# EAGLE design PLclose (EAGLE 9.4.2)
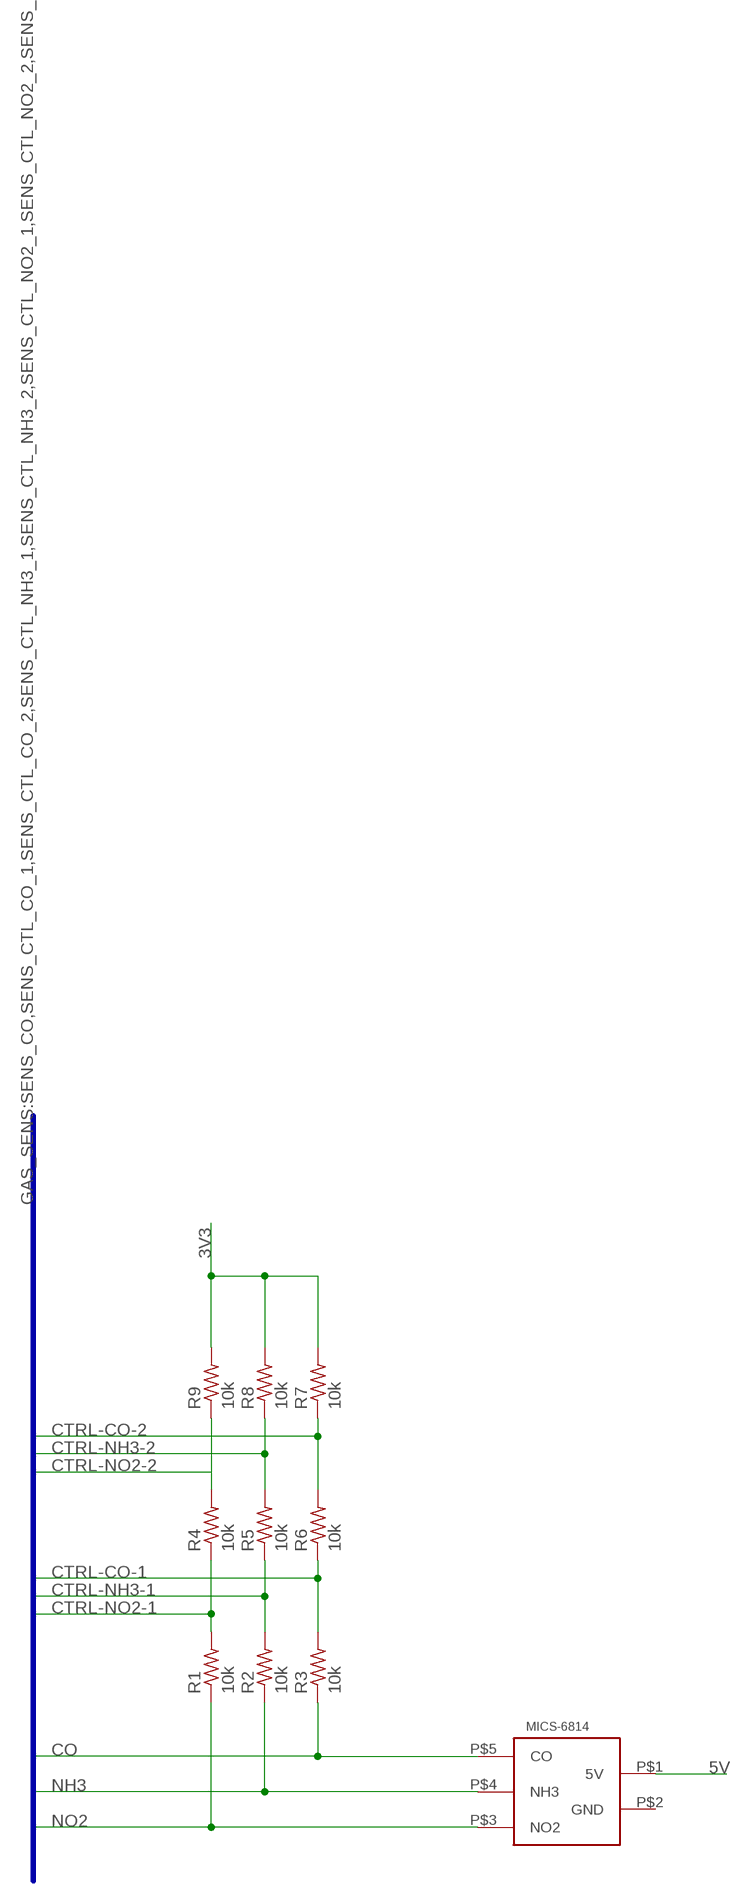
[diagram p0: schematic, sheet 1]

## Parts
MICS-6814  MICS-6814  [MICS-6814]
R1  10k  R-US_R0603  [R0603]
R2  10k  R-US_R0603  [R0603]
R3  10k  R-US_R0603  [R0603]
R4  10k  R-US_R0603  [R0603]
R5  10k  R-US_R0603  [R0603]
R6  10k  R-US_R0603  [R0603]
R7  10k  R-US_R0603  [R0603]
R8  10k  R-US_R0603  [R0603]
R9  10k  R-US_R0603  [R0603]

## Nets
3V3: R7.2 R8.2 R9.2
5V: MICS-6814.P$1(5V)
CO: MICS-6814.P$5(CO) R3.1
CTRL-CO-1: R3.2 R6.1
CTRL-CO-2: R6.2 R7.1
CTRL-NH3-1: R2.2 R5.1
CTRL-NH3-2: R5.2 R8.1
CTRL-NO2-1: R1.2 R4.1
CTRL-NO2-2: R4.2 R9.1
NH3: MICS-6814.P$4(NH3) R2.1
NO2: MICS-6814.P$3(NO2) R1.1
Unconnected: MICS-6814.P$2(GND)

## Buses
GAS_SENS:SENS_CO,SENS_CTL_CO_1,SENS_CTL_CO_2,SENS_CTL_NH3_1,SENS_CTL_NH3_2,SENS_CTL_NO2_1,SENS_CTL_NO2_2,SENS_NH3,SENS_NO2

## Library data of the parts
MICS-6814 = CanCubeSat:MICS-6814
R1-R9 = resistor:R-US_: RESISTOR, American symbol

## Board
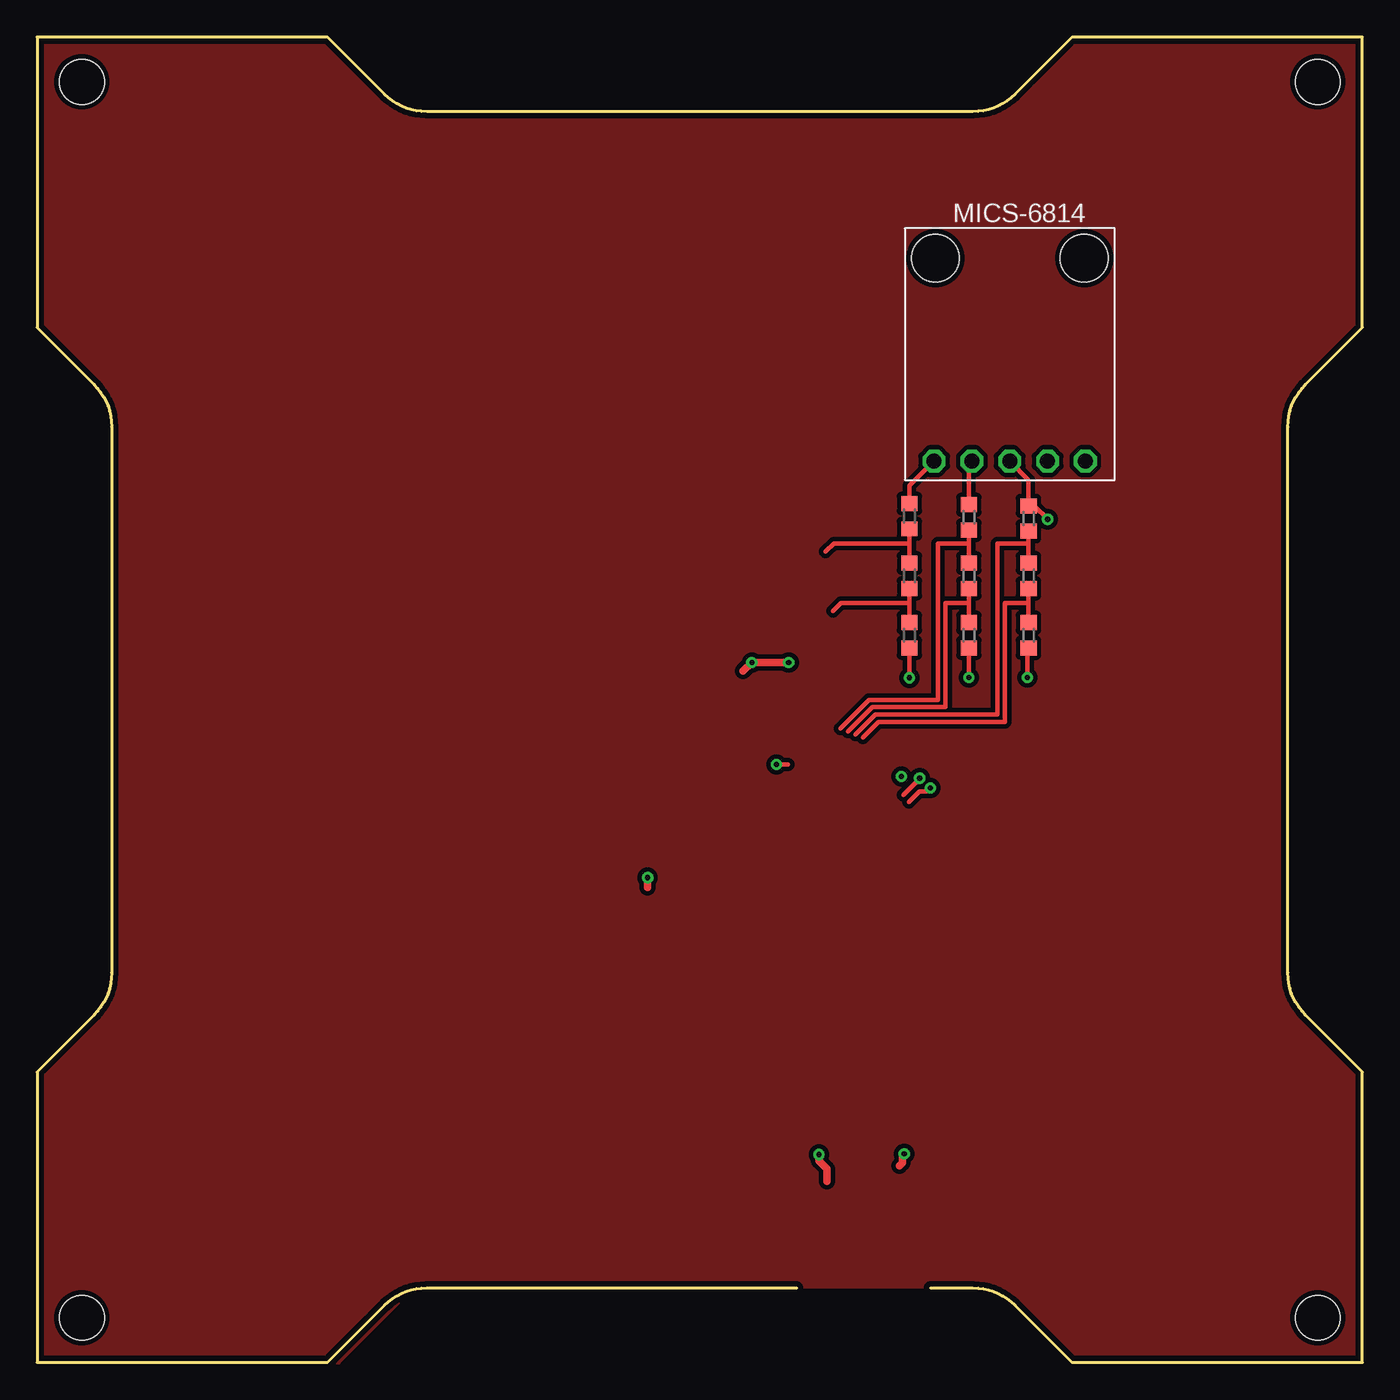
[diagram p1: board, top side]
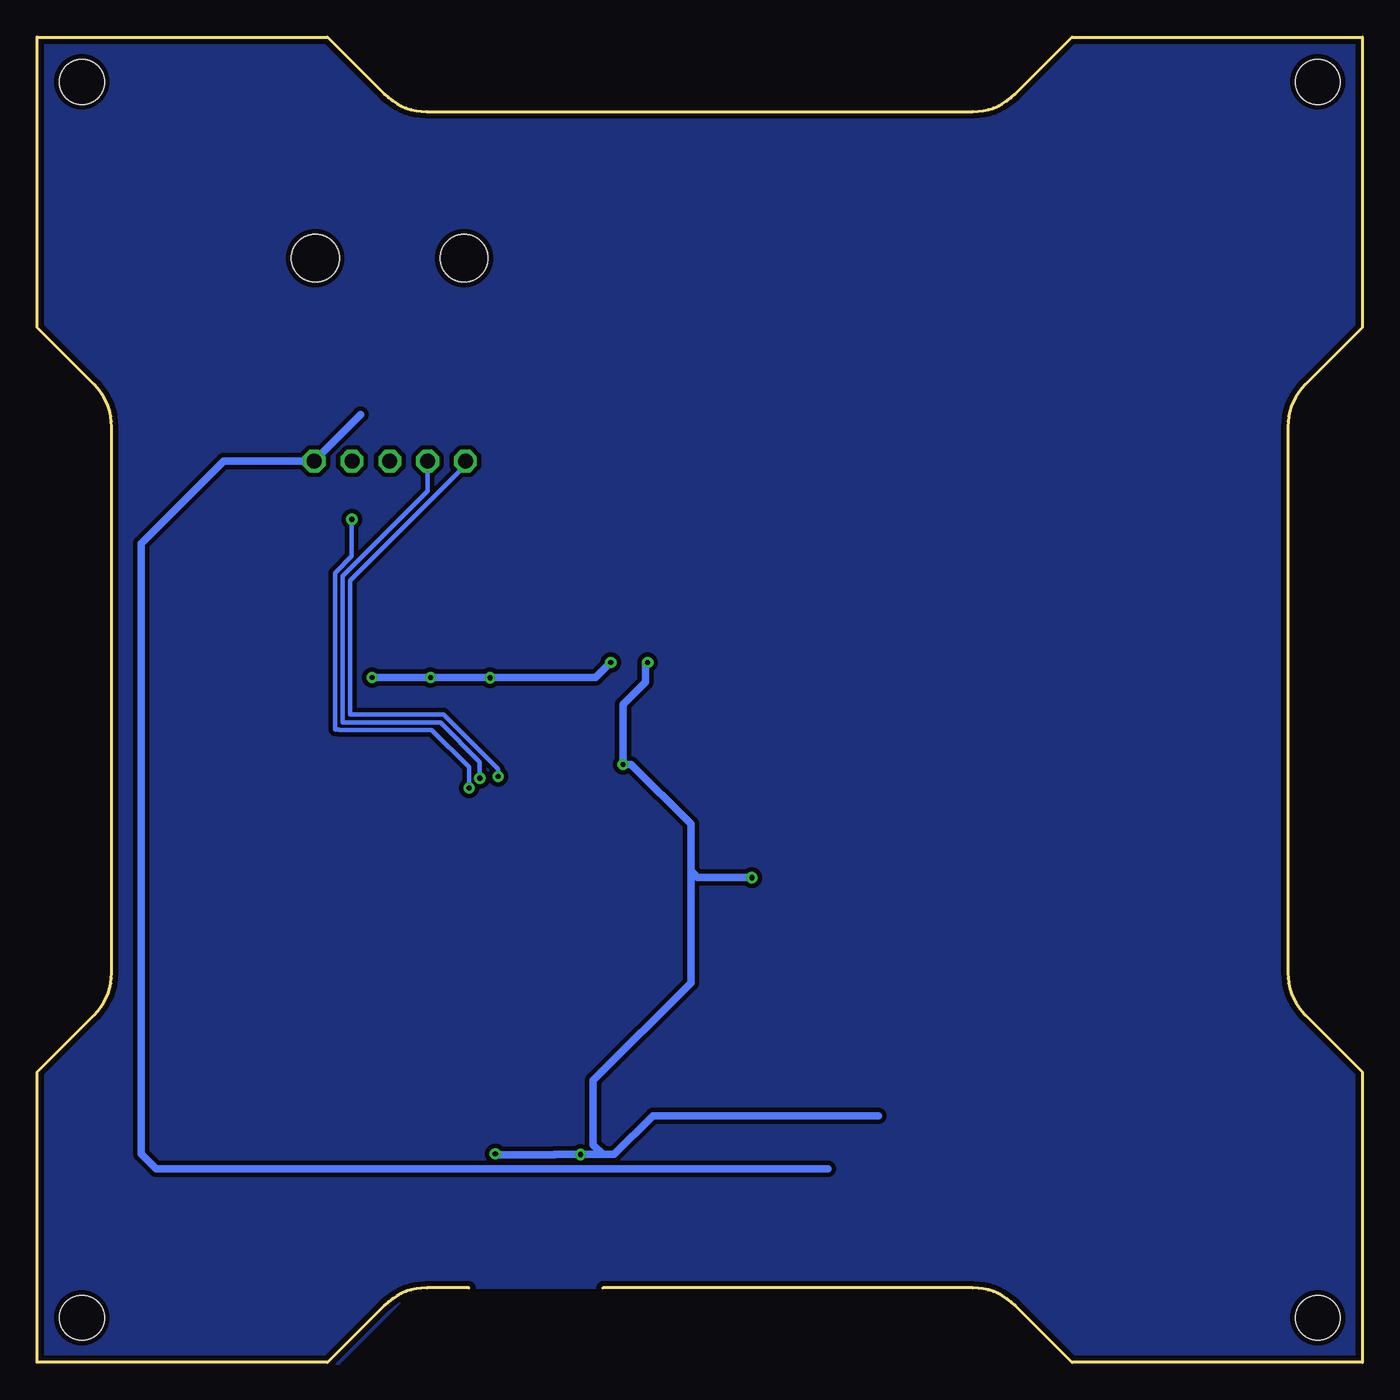
[diagram p2: board, bottom side, seen from below]

Size 89 x 89 mm. Coordinates in mm from the lower left corner, seen from the top.
Outline: 51,5 26.16,5 arc45 23.33,3.83 19.5,0 0,0 0,19.5 3.83,23.33 arc45 5,26.16 5,62.84 arc45 3.83,65.67 0,69.5 0,89 19.5,89 23.33,85.17 arc45 26.16,84 62.84,84 arc45 65.67,85.17 69.5,89 89,89 89,69.5 85.17,65.67 arc45 84,62.84 84,26.16 arc45 85.17,23.33 89,19.5 89,0 69.5,0 65.67,3.83 arc45 62.84,5 60,5
Copper layers (1*16): Top 0.035mm / dielectric 1.5mm / Bottom 0.035mm
Design rules "default *": minimum track width 0.3mm, minimum drill 0.35mm, track to track 0.2mm, track to pad 0.2mm, pad to pad 0.2mm, via to via 0.2mm, smd to smd 0.2mm, copper to edge 0.35mm, drill to drill 6mil, minimum pad ring 10mil, minimum via ring 8mil, stop-mask expansion 2mil, vias tented up to drill 0mil, thermal gap 10mil
Holes 3 mm at 3,3 86,3 86,86 3,86

### Footprints (pad centres in the part's own frame; a part is rotated, then mirrored left to right if it is on the bottom)
MICS-6814 = drill 1.016 octagon: P$1 -5.08,7.18; P$2 -2.54,7.18; P$3 0,7.18; P$4 2.54,7.18; P$5 5.08,7.18 | hole 3.2: -5,-6.45; 5,-6.45
R0603 = smd 1 x 1.1: 1 -0.85,0; 2 0.85,0

### Placement (x,y rotation side)
MICS-6814  65.32,67.71 180 top
R1  66.58,56.67 270 top
R2  62.58,56.75 270 top
R3  58.58,56.83 270 top
R4  66.58,52.83 270 top
R5  62.58,52.83 270 top
R6  58.58,52.83 270 top
R7  58.58,48.83 270 top
R8  62.58,48.83 270 top
R9  66.58,48.83 270 top

### Tracks (layer width: path | path; a pad name or v marks a point on that pad's centre or on a via)
3V3  (via drill 0.35)
  Top 0.3: 50.42,40.15 v49.65,40.15 49.6,40.2 | v66.5,46 66.5,47.9 R9.2 | R8.2 v62.58,46 | v58.58,45.98 R7.2
  Top 0.5: 47.42,46.42 v48,47 v50.48,47 | 41,31.9 v41,32.55 | 53.05,12.15 53.05,12.99 52.5,13.54 v52.5,13.95 | v58.23,14 58.1,13.87 58.1,13.39 57.9,13.19
  Bottom 0.3: 62.48,45.98 v62.58,46
  Bottom 0.5: 51,13.95 v52.5,13.95 54.25,13.95 58.18,13.95 v58.23,14 | 51,13.95 50.25,13.95 47.65,16.55 32.5,16.55 | 45.1,33 45.1,25.48 51.65,18.93 51.65,14.61 51,13.95 | 45.1,33 45.1,36.15 49.1,40.15 v49.65,40.15 49.65,44.18 48.15,45.68 48.15,46.85 v48,47 | v41,32.55 44.65,32.55 45.1,33 | v50.48,47 51.5,45.98 v58.58,45.98 62.48,45.98 | v62.58,46 v66.5,46
5V
  Bottom 0.5: 67.28,63.65 MICS-6814.P$1 76.47,60.53 82,55 82,14 81,13 35.89,13
CO  (via drill 0.35)
  Top 0.3: MICS-6814.P$5 58.58,58.87 R3.1 | v58.05,39.35 58.05,39.22
  Bottom 0.3: MICS-6814.P$5 60.24,60.26 68,52.5 68,43.5 61.7,43.5 58.05,39.85 v58.05,39.35
CTRL-CO-1
  Top 0.3: R3.2 58.58,55 | 58.58,55 R6.1 | 52.95,54.45 53.5,55 58.58,55
CTRL-CO-2
  Top 0.3: R6.2 58.58,51 | 58.58,51 R7.1 | 58.58,51 54,51 53.45,50.45
CTRL-NH3-1
  Top 0.3: R2.2 62.58,55 | 62.58,55 R5.1 | 53.95,42.57 55.88,44.5 60.5,44.5 60.5,55 62.58,55
CTRL-NH3-2
  Top 0.3: R5.2 62.58,51 | 62.58,51 R8.1 | 54.45,42.36 56.09,44 61,44 61,51 62.58,51
CTRL-NO2-1
  Top 0.3: R1.2 66.58,55 | 66.58,55 R4.1 | 54.95,42.16 56.29,43.5 64.5,43.5 64.5,55 66.58,55
CTRL-NO2-2
  Top 0.3: R4.2 66.58,51 | 66.58,51 R9.1 | 66.58,51 65,51 65,43 56.5,43 55.45,41.95
GND
  pour Top (isolate 0.3, no thermals): -0.05,89.05 19.85,89.05 24.75,84.15 64.2,84.15 69.1,89.05 88.95,89.05 88.95,69.45 84.25,64.75 84.25,64.15 83.95,63.85 83.95,25.25 84.35,24.85 89,19.48 89,0 69.5,0 65.05,4.45 64.55,4.45 64.15,4.85 63.65,4.85 63.45,5.05 25.37,5.05 20.27,-0.05 0.25,-0.05 0.05,0.15 0.05,19.65 4.15,23.75 4.15,23.95 4.65,24.45 4.65,24.95 4.85,25.15 4.85,64.15 4.55,64.45 4.55,64.95 -0.05,69.55
  pour Bottom (isolate 0.3, no thermals): 89.05,89 69.15,89 64.25,84.1 24.8,84.1 19.9,89 0.05,89 0.05,69.4 4.75,64.7 4.75,64.1 5.05,63.8 5.05,25.2 4.65,24.8 0,19.43 0,-0.05 19.5,-0.05 23.95,4.4 24.45,4.4 24.85,4.8 25.35,4.8 25.55,5 63.63,5 68.73,-0.1 88.75,-0.1 88.95,0.1 88.95,19.6 84.85,23.7 84.85,23.9 84.35,24.4 84.35,24.9 84.15,25.1 84.15,64.1 84.45,64.4 84.45,64.9 89.05,69.5
NH3  (via drill 0.35)
  Top 0.3: MICS-6814.P$4 62.58,60.33 R2.1 | 58.2,38.12 58.4,38.33 58.4,38.35 v59.27,39.23
  Bottom 0.3: v59.27,39.23 59.27,40.33 61.92,42.98 68.5,42.98 68.5,52.81 62.78,58.53 MICS-6814.P$4
NO2  (via drill 0.35)
  Top 0.3: MICS-6814.P$3 66.58,59.27 R1.1 66.97,57.52 v67.87,56.62 | 58.54,37.62 59.27,38.35 59.77,38.35 v60,38.58
  Bottom 0.3: v67.87,56.62 67.87,54.15 69,53.02 69,42.5 68.73,42.5 68.71,42.48 62.5,42.48 60,39.98 v60,38.58